# Altium schematic sheet Sheet1.SchDoc
size A
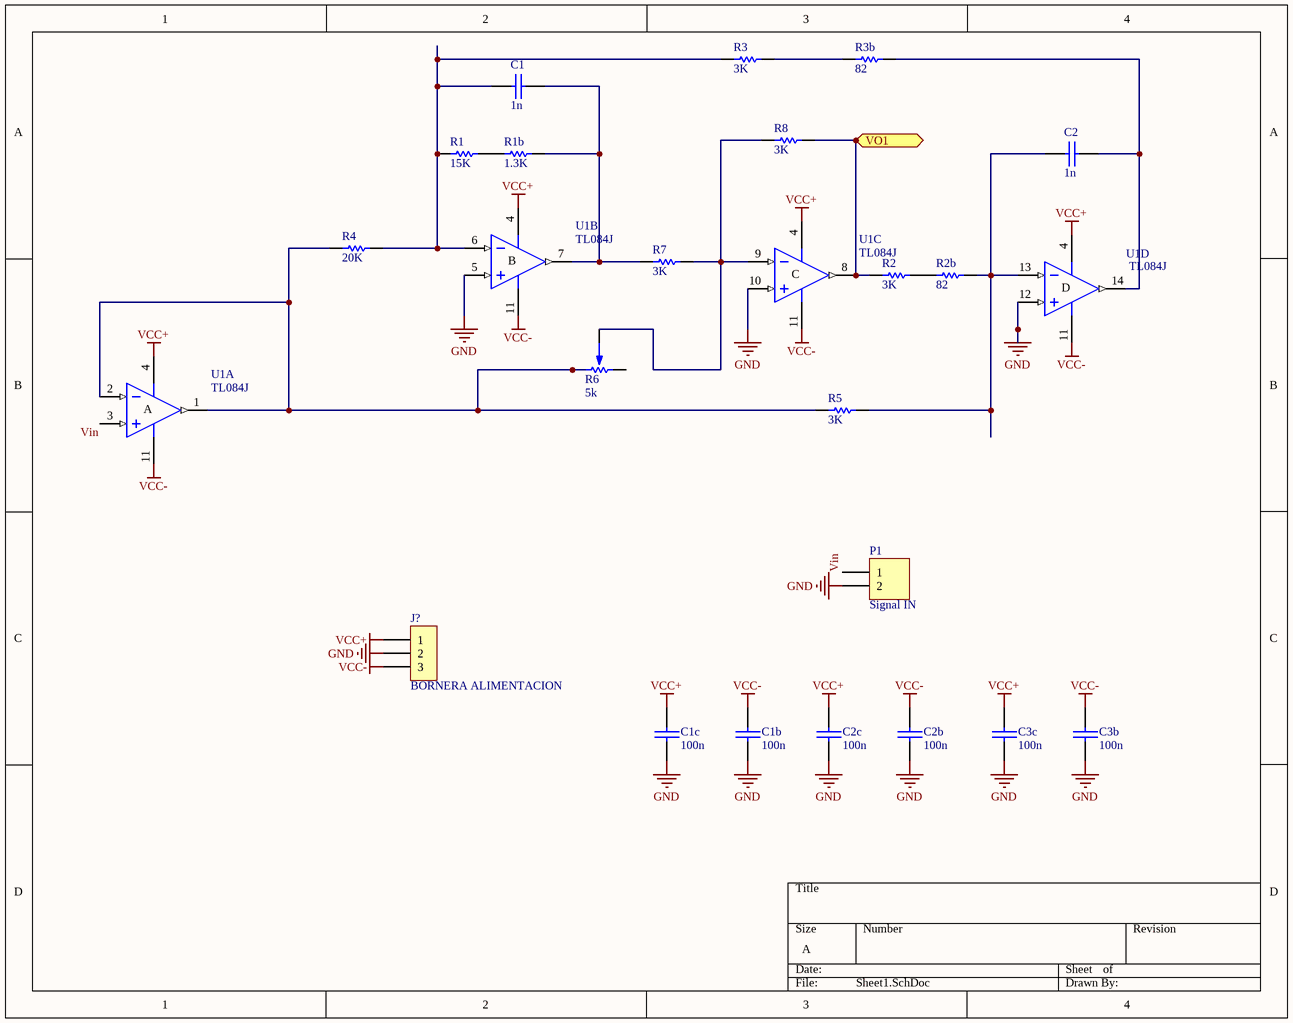
[diagram p0: Sheet1.SchDoc]

## Parts
C1  1n  [CAP100]
C1b  100n  [CAP100]
C1c  100n  [CAP100]
C2  1n  [CAP100]
C2b  100n  [CAP100]
C2c  100n  [CAP100]
C3b  100n  [CAP100]
C3c  100n  [CAP100]
J?  BORNERA ALIMENTACION  [BORNERA3]
P1  Signal IN  [HDR1X2]
R1  15K  [0805]
R1b  1.3K  [0805]
R2  3K  [0805]
R2b  82  [0805]
R3  3K  [0805]
R3b  82  [0805]
R4  20K  [0805]
R5  3K  [0805]
R6  5k  [PRESET V]
R7  3K  [0805]
R8  3K  [0805]
U1  TL084J  [J014]  (parts A,B,C,D of 4)

## Ports
VO1

## Nets
GND: C1b.2 C1c.2 C2b.2 C2c.2 C3b.2 C3c.2 J?.2 P1.2 U1.5(IN+) U1.10(IN+) U1.12(IN+)
VCC+: C1c.1 C2c.1 C3c.1 J?.1 U1.4(V+)
VCC-: C1b.1 C2b.1 C3b.1 J?.3 U1.11(V-)
Vin: P1.1 U1.3(IN+)
VO1: R2.1 R8.2 U1.8(OUT) ; port VO1
NetC1_1: C1.1 R1.1 R3.1 R4.2 U1.6(IN-)
NetC1_2: C1.2 R1b.2 R7.1 U1.7(OUT)
NetC2_1: C2.1 R2b.2 R5.2 U1.13(IN-)
NetC2_2: C2.2 R3b.2 U1.14(OUT)
NetR1_2: R1.2 R1b.1
NetR2_2: R2.2 R2b.1
NetR3_2: R3.2 R3b.1
NetR4_1: R4.1 R5.1 R6.1 U1.1(OUT) U1.2(IN-)
NetR6_2: R6.2 R7.2 R8.1 U1.9(IN-)

Not connected (* = marked no-connect by the designer): R6 3

## Notes on the sheet
- (in symbol TL084J, part A) A
- (in symbol TL084J, part B) B
- (in symbol TL084J, part C) C
- (in symbol TL084J, part D) D

## Library data of the parts
C1 C1b C1c C2 C2b C2c C3b C3c = CAP
J? = BORNERA 3
P1 = Header 2: Header, 2-Pin; LatestRevisionDate: 17-Jul-2002; LatestRevisionNote: Re-released for DXP Platform.; Publisher: Altium Limited
R1 R1b R2 R2b R3 R3b R4 R5 R7 R8 = RES
R6 = PRESET
U1 = TL084J: JFET-Input Operational Amplifier; Published: 16-Jan-2001; LatestRevisionDate: 04-Mar-2005; LatestRevisionNote: Stylized 3D Model Added.; DatasheetVersion: Feb-1999; PackageVersion: Jun-1999; PackageReference: J014; Publisher: Altium Limited; PackageDescription: DIP; 14 Leads; Row Spacing 7.62 mm; Pitch 2.54 mm; ComponentLink1Description: Manufacturer Link; ComponentLink1URL: http://www.ti.com/; ComponentLink2Description: Datasheet; ComponentLink2URL: http://www-s.ti.com/sc/ds/tl084.pdf